# EAGLE design Codeshelf-0007.v02 (EAGLE 6.5.0)
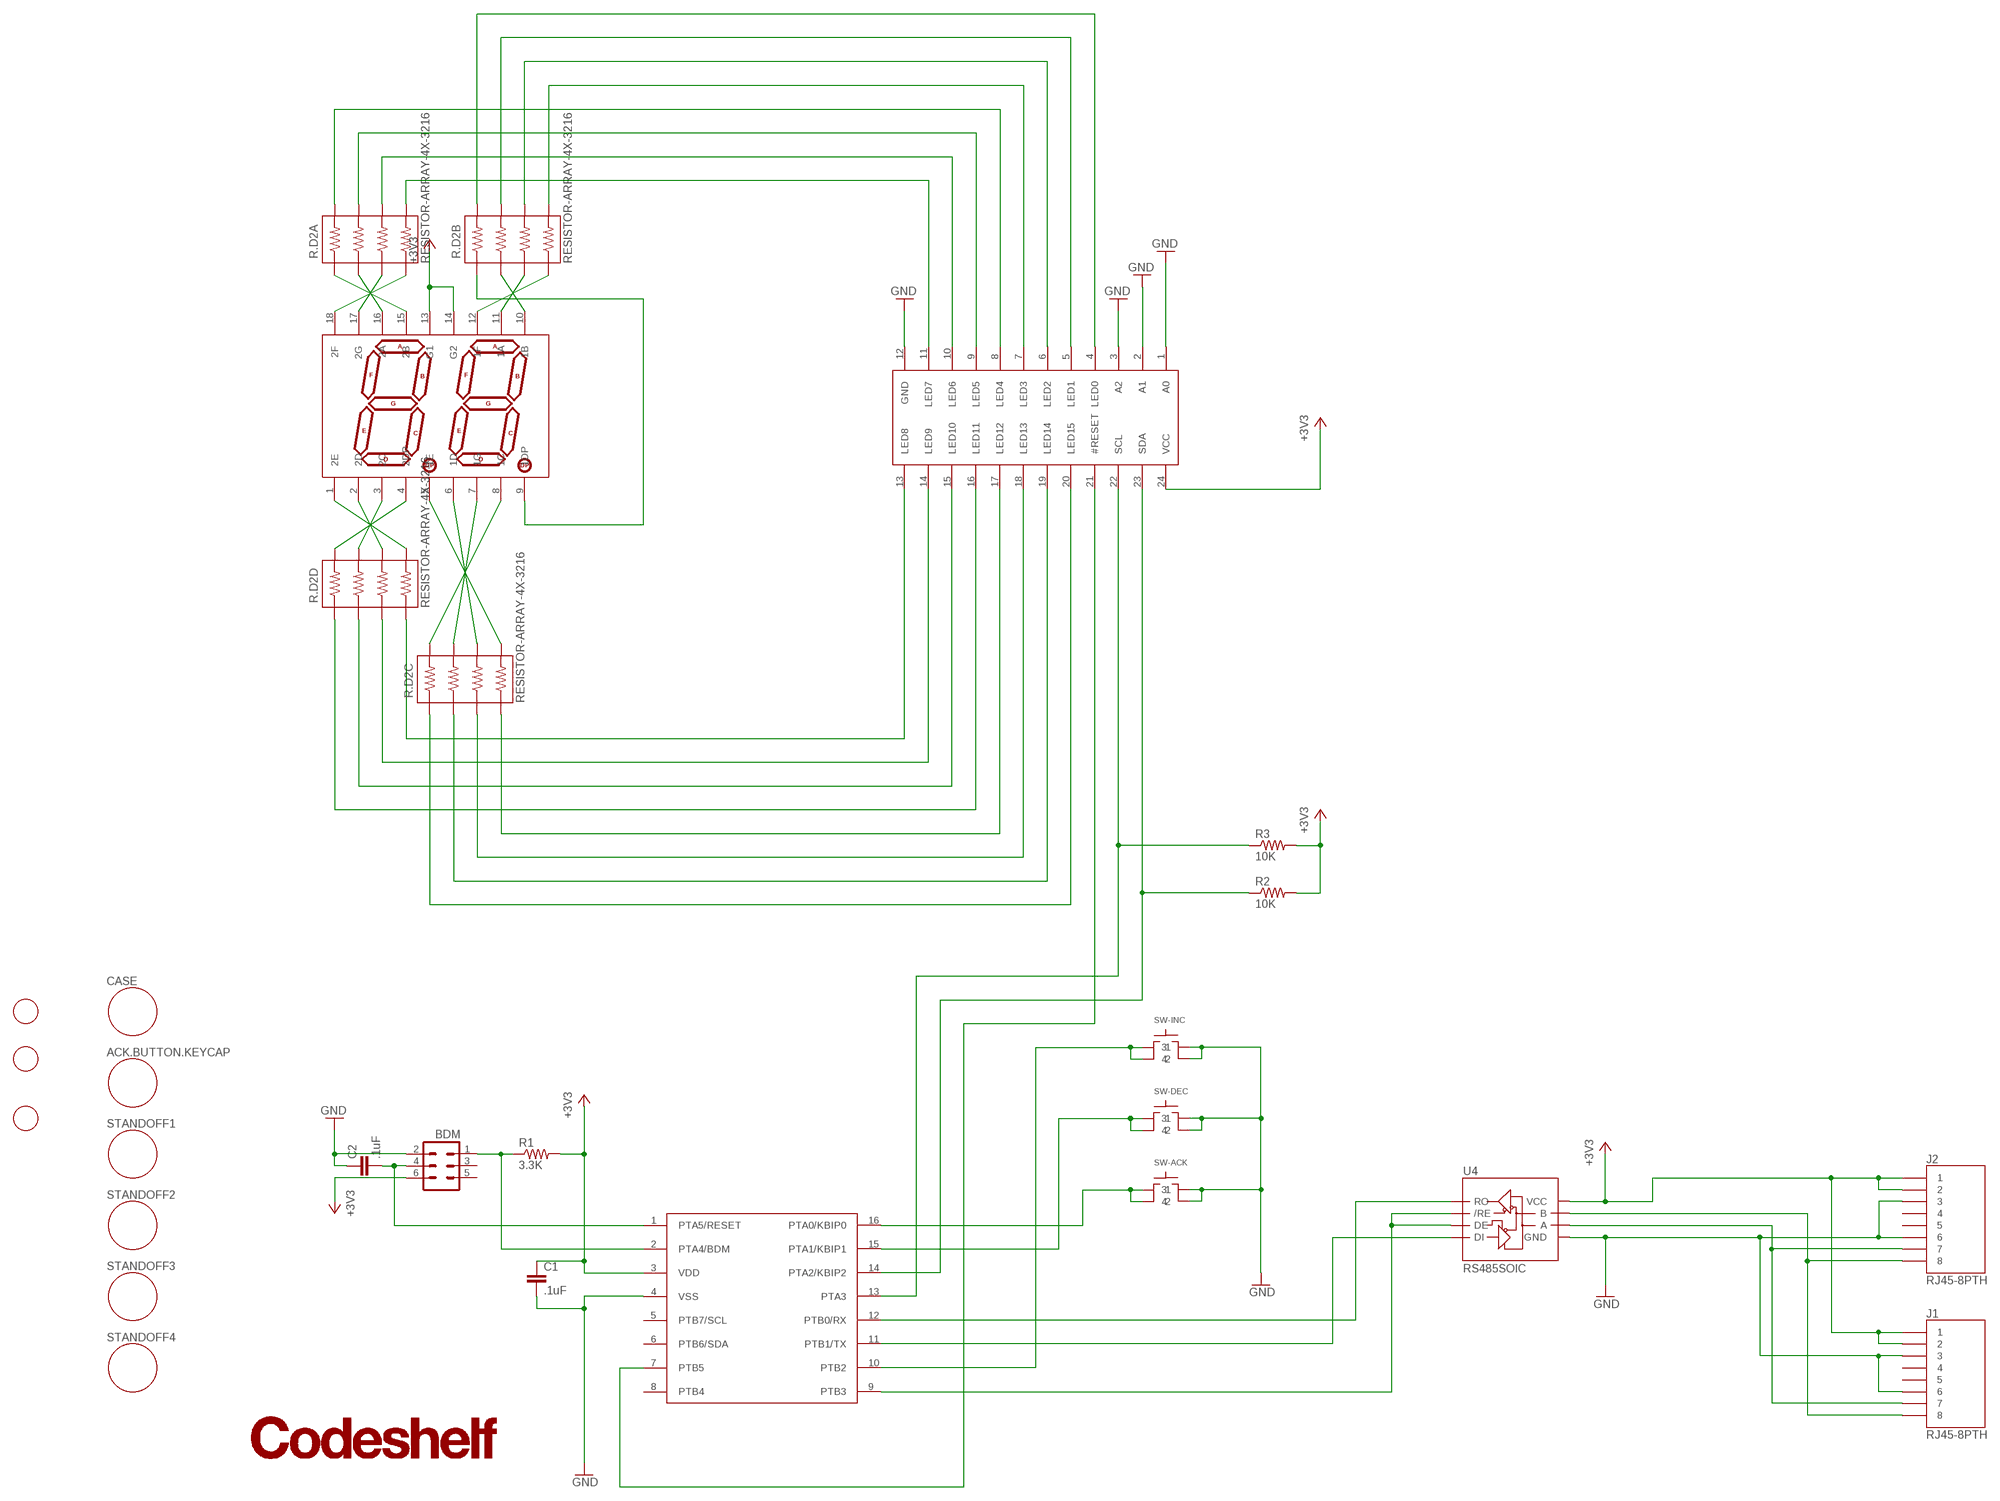
[diagram p0: schematic, sheet 1]

## Parts
ACK.BUTTON.KEYCAP  EXTERNAL-COMPONENT  [EXTERNAL-COMPONENT]
BDM  HEADER-3X2  [HEADER-3X2]
C1  .1uF  RF-C0402  [C0402]
C2  .1uF  RF-C0402  [C0402]
CASE  EXTERNAL-COMPONENT  [EXTERNAL-COMPONENT]
J1  RJ45-8PTH  [RJ45-8]
J2  RJ45-8PTH  [RJ45-8]
LOGO  CODESHELF-LOGO  [CODESHELF-LOGO]
R1  3.3K  RF-R0402  [RF-R0402]
R2  10K  RF-R0402  [RF-R0402]
R3  10K  RF-R0402  [RF-R0402]
R.D2A  RESISTOR-ARRAY-4X-3216  [3216-4X]
R.D2B  RESISTOR-ARRAY-4X-3216  [3216-4X]
R.D2C  RESISTOR-ARRAY-4X-3216  [3216-4X]
R.D2D  RESISTOR-ARRAY-4X-3216  [3216-4X]
STANDOFF1  EXTERNAL-COMPONENT  [EXTERNAL-COMPONENT]
STANDOFF2  EXTERNAL-COMPONENT  [EXTERNAL-COMPONENT]
STANDOFF3  EXTERNAL-COMPONENT  [EXTERNAL-COMPONENT]
STANDOFF4  EXTERNAL-COMPONENT  [EXTERNAL-COMPONENT]
SW-ACK  SWITCH-TACTILE-320.03E11  [SWITCH-TACTILE-320.03E11]
SW-DEC  SWITCH-TACTILE-FSM  [SWITCH-TACTILE-FSM]
SW-INC  SWITCH-TACTILE-FSM  [SWITCH-TACTILE-FSM]
U2  MC9S08QG-DT  [TSSOP16]
U3  CAT9552  [TSSOP24]
U4  RS485SOIC  [SO08]
U7  7SEGMENT-2DIGIT  [7SEGMENT-2DIG-.54]
U$1  FIDUCIAL  [FIDUCIAL_1MM]
U$2  FIDUCIAL  [FIDUCIAL_1MM]
U$3  FIDUCIAL  [FIDUCIAL_1MM]

## Nets
+3V3 [+3V3]: BDM.6 C1.1 J1.1 J1.2 J2.1 J2.2 R1.2 R2.2 R3.2 U2.3(VDD) U3.24(VCC) U4.8(VCC) U7.13(G1) U7.14(G2)
GND [GND]: BDM.2 C1.2 C2.1 J1.3 J1.6 J2.3 J2.6 SW-ACK.P$3 SW-ACK.P$4 SW-DEC.P$3 SW-DEC.P$4 SW-INC.P$3 SW-INC.P$4 U2.4(VSS) U3.1(A0) U3.2(A1) U3.3(A2) U3.12(GND) U4.5(GND)
N$1: R.D2A.5(4B) U3.11(LED7)
N$2: R.D2A.6(3B) U3.10(LED6)
N$3: R.D2A.7(2B) U3.9(LED5)
N$4: R.D2A.8(1B) U3.8(LED4)
N$5: R.D2B.5(4B) U3.7(LED3)
N$6: SW-ACK.P$1 SW-ACK.P$2 U2.16(PTA0/KBIP0)
N$7: SW-DEC.P$1 SW-DEC.P$2 U2.15(PTA1/KBIP1)
N$8: SW-INC.P$1 SW-INC.P$2 U2.10(PTB2)
N$9: BDM.1 R1.1 U2.2(PTA4/BDM)
N$10: R.D2B.6(3B) U3.6(LED2)
N$11: R.D2B.7(2B) U3.5(LED1)
N$12: R.D2B.8(1B) U3.4(LED0)
N$13: R.D2D.8(1B) U7.4(2DP)
N$14: R.D2D.7(2B) U7.3(2C)
N$15: R.D2D.6(3B) U7.2(2D)
N$16: R.D2D.5(4B) U7.1(2E)
N$17: R.D2A.1(1A) U7.15(2B)
N$18: R.D2A.2(2A) U7.16(2A)
N$19: U2.9(PTB3) U4.2(/RE) U4.3(DE)
N$20: R.D2A.3(3A) U7.17(2G)
N$21: R.D2A.4(4A) U7.18(2F)
N$22: R.D2B.4(4A) U7.12(1F)
N$23: BDM.4 C2.2 U2.1(PTA5/RESET)
N$24: R.D2B.3(3A) U7.11(1A)
N$25: R.D2C.8(1B) U7.8(1C)
N$26: R.D2C.7(2B) U7.7(1G)
N$27: R.D2C.6(3B) U7.6(1D)
N$28: R.D2C.5(4B) U7.5(1E)
N$29: R.D2B.1(1A) U7.9(1DP)
N$30: R.D2B.2(2A) U7.10(1B)
N$31: R.D2D.4(4A) U3.13(LED8)
N$32: R.D2D.3(3A) U3.14(LED9)
N$33: R.D2D.2(2A) U3.15(LED10)
N$34: R.D2D.1(1A) U3.16(LED11)
N$35: R.D2C.4(4A) U3.17(LED12)
N$36: R.D2C.3(3A) U3.18(LED13)
N$37: R.D2C.2(2A) U3.19(LED14)
N$38: R.D2C.1(1A) U3.20(LED15)
RESET: U2.7(PTB5) U3.21(#RESET)
RS485_N: J1.8 J2.8 U4.7(B)
RS485_P: J1.7 J2.7 U4.6(A)
RX: U2.12(PTB0/RX) U4.1(RO)
SLA: R2.1 U2.14(PTA2/KBIP2) U3.23(SDA)
SLC: R3.1 U2.13(PTA3) U3.22(SCL)
TX: U2.11(PTB1/TX) U4.4(DI)
Unconnected: BDM.3 BDM.5 J1.4 J1.5 J2.4 J2.5 U2.5(PTB7/SCL) U2.6(PTB6/SDA) U2.8(PTB4)

## Library data of the parts
ACK.BUTTON.KEYCAP = GW-devices:EXTERNAL-COMPONENT: Use this device to note external components needed for the BOM; MFGN: ESwitch; MFGP: 320.08RED; NOTES: DNP - non-board part; PRICE: 0.87
BDM = GW-devices:HEADER-3X2
C1 C2 = GW-devices:RF-C: RF capacitor pads for FSL reference design; MFGN: Murata; MFGP: GRM155R61C104KA88D; PRICE: 0.02
CASE = GW-devices:EXTERNAL-COMPONENT: Use this device to note external components needed for the BOM; MFGN: Bud Industries; MFGP: PN-1321-C; NOTES: DNP - non-board part; PRICE: 8.50
J1 = GW-devices:RJ45-8: RJ45 Jack MFG part number 54602-908lf; MFGN: FCI; MFGP: 54602-908LF; PRICE: 0.02
J2 = GW-devices:RJ45-8: RJ45 Jack MFG part number 54602-908lf; MFGN: FCI; MFGP: 54602-908LF; PRICE: 0.57
LOGO = GW-devices:CODESHELF-LOGO
R1 = GW-devices:RF-R: RF resistor pads for FSL reference design; MFGN: Panasonic; MFGP: ERJ-2GEJ332X; PRICE: 0.02
R2 R3 = GW-devices:RF-R: RF resistor pads for FSL reference design; MFGN: Panasonic; MFGP: ERJ-2GEJ103X; PRICE: 0.02
R.D2A R.D2B R.D2C R.D2D = GW-devices:RESISTOR-ARRAY-4X; MFGN: Yageo; MFGP: YC164-JR-07120RL; PRICE: 0.006
STANDOFF1-STANDOFF4 = GW-devices:EXTERNAL-COMPONENT: Use this device to note external components needed for the BOM; MFGN: Harwin; MFGP: R30-3001502; NOTES: DNP - non-board part; PRICE: 1.00
SW-ACK = GW-devices:SWITCH-TACTILE; MFGN: ESwitch; MFGP: 320.03E11
SW-DEC SW-INC = GW-devices:SWITCH-TACTILE; MFGN: TE Connectivity; MFGP: FSM16JH; PRICE: 0.18
U2 = GW-devices:MC9S08QG; MFGN: Freescale; MFGP: MC9S08QG8CDTER; PRICE: 1.73
U3 = GW-devices:CAT9552; MFGN: On Semiconductor; MFGP: CAT9552YI-T2; PRICE: 1.28
U4 = SparkFun:RS485; MFGN: TI; MFGP: SN65HVD1781DR; PRICE: 4.29
U7 = GW-devices:7SEGMENT-2DIGIT: 7-Segment Display 1" Red (COM-08546); MFGN: Avago; MFGP: HDSP-521E; PRICE: 0.83
U$1-U$3 = adafruit:FIDUCIAL: For use by pick and place machines to calibrate the vision/machine, 1mm By microbuilder.eu

## Net classes
1 +3V3: width 0.3 mm
2 GND: width 0.3 mm
3 RS485: width 0.4 mm

## Board
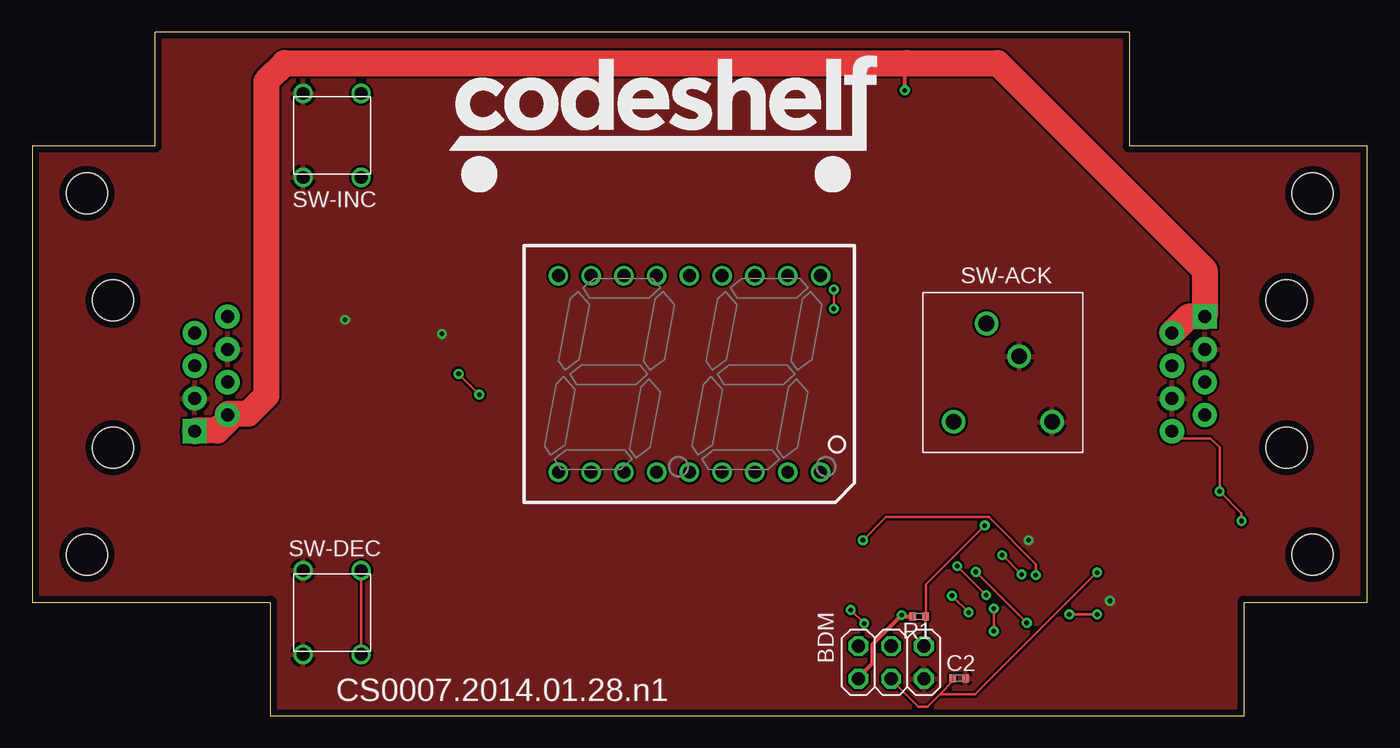
[diagram p1: board, top side]
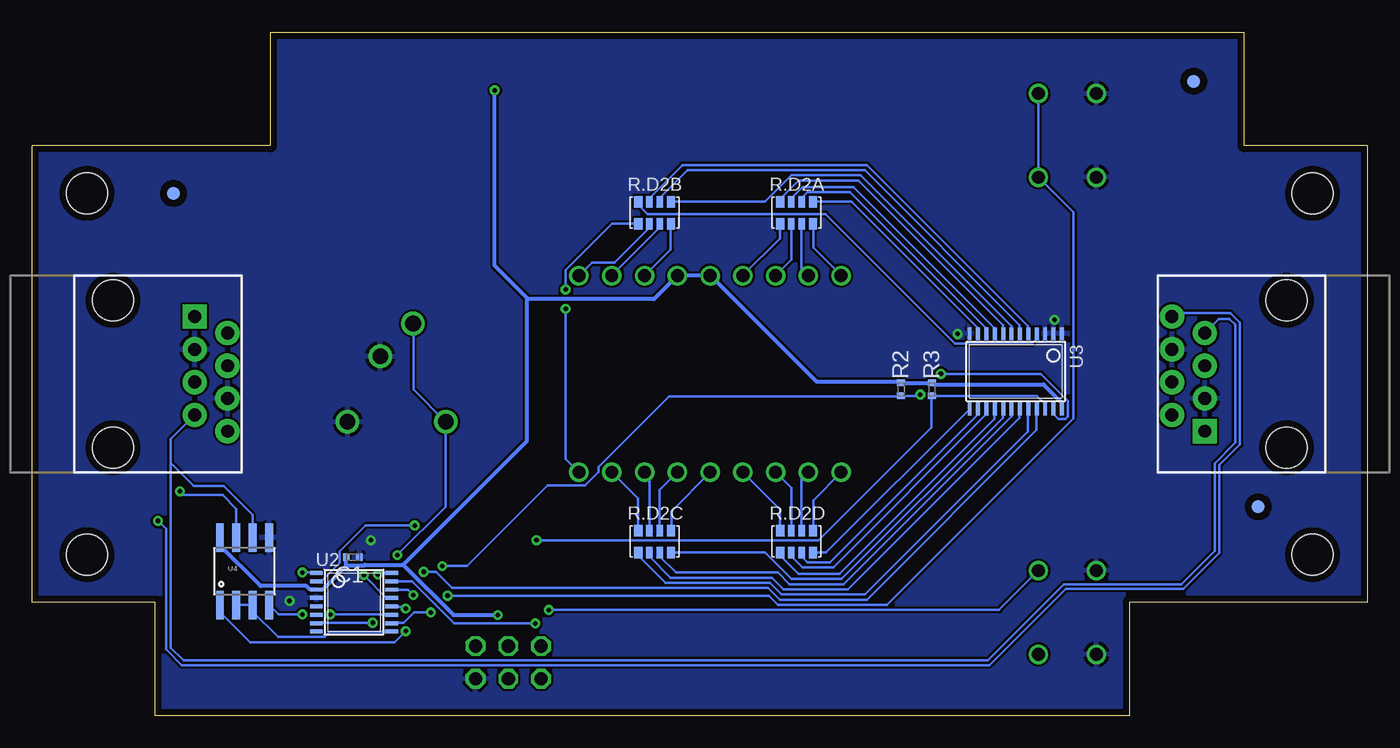
[diagram p2: board, bottom side, seen from below]

Size 103.5 x 53 mm. Coordinates in mm from the lower left corner, seen from the top.
Outline: 18.45,0 93.95,0 93.95,8.8 103.5,8.8 103.5,44.2 85.05,44.2 85.05,53 9.55,53 9.55,44.2 0,44.2 0,8.8 18.45,8.8 18.45,0
Copper layers (1*16): Top 0.0356mm / dielectric 1.5011mm / Bottom 0.0356mm
Design rules "SilverCircuits": minimum track width 7mil, minimum drill 14mil, track to track 7mil, track to pad 7mil, pad to pad 7mil, via to via 7mil, smd to smd 0mil, copper to edge 20mil, drill to drill 8mil, minimum pad ring 10mil, minimum via ring 8mil, stop-mask expansion 4mil, vias tented up to drill 0mil, thermal gap 10mil
Holes 3.2 mm at 4.25,12.5 4.25,40.5 99.25,40.5 99.25,12.5

### Footprints (pad centres in the part's own frame; a part is rotated, then mirrored left to right if it is on the bottom)
HEADER-3X2 = drill 1.016 octagon: 1 -5.08,0; 2 -5.08,2.54; 3 -2.54,0; 4 -2.54,2.54; 5 0,0; 6 0,2.54
C0402 = smd 0.5 x 0.6: 1 -0.5,0; 2 0.5,0
RJ45-8 = drill 1 pad 1.88 square: 1 -4.445,6.35 | drill 1 pad 1.88: 2 -3.175,8.89; 3 -1.905,6.35; 4 -0.635,8.89; 5 0.635,6.35; 6 1.905,8.89; 7 3.175,6.35; 8 4.445,8.89 | hole 3.2: -5.715,0; 5.715,0
RF-R0402 = smd 0.5 x 0.6: 1 -0.5,0; 2 0.5,0
3216-4X = smd 0.65 x 0.9: 1 -1.275,-0.85; 4 1.275,-0.85; 5 1.275,0.85; 8 -1.275,0.85 | smd 0.5 x 0.9: 2 -0.4,-0.85; 3 0.4,-0.85; 6 0.4,0.85; 7 -0.4,0.85
SWITCH-TACTILE-320.03E11 = drill 1.22: P$1 -3.81,-3.81; P$2 -1.27,3.81; P$3 1.27,1.27; P$4 3.81,-3.81
SWITCH-TACTILE-FSM = drill 0.99: P$1 -3.25,2.25; P$2 3.25,2.25; P$3 -3.25,-2.25; P$4 3.25,-2.25
TSSOP16 = smd 0.305 x 0.991: 1 -2.275,-2.918; 2 -1.625,-2.918; 3 -0.975,-2.918; 4 -0.325,-2.918; 5 0.325,-2.918; 6 0.975,-2.918; 7 1.625,-2.918; 8 2.275,-2.918; 9 2.275,2.918; 10 1.625,2.918; 11 0.975,2.918; 12 0.325,2.918; 13 -0.325,2.918; 14 -0.975,2.918; 15 -1.625,2.918; 16 -2.275,2.918
TSSOP24 = smd 0.305 x 0.991: 1 -3.575,-2.918; 2 -2.925,-2.918; 3 -2.275,-2.918; 4 -1.625,-2.918; 5 -0.975,-2.918; 6 -0.325,-2.918; 7 0.325,-2.918; 8 0.975,-2.918; 9 1.625,-2.918; 10 2.275,-2.918; 11 2.925,-2.918; 12 3.575,-2.918; 13 3.575,2.918; 14 2.925,2.918; 15 2.275,2.918; 16 1.625,2.918; 17 0.975,2.918; 18 0.325,2.918; 19 -0.325,2.918; 20 -0.975,2.918; 21 -1.625,2.918; 22 -2.275,2.918; 23 -2.925,2.918; 24 -3.575,2.918
SO08 = smd 0.61 x 2.21: 1 -1.905,-2.616; 2 -0.635,-2.616; 3 0.635,-2.616; 4 1.905,-2.616; 5 1.905,2.616; 6 0.635,2.616; 7 -0.635,2.616; 8 -1.905,2.616
7SEGMENT-2DIG-.54 = drill 1: 1 -10.16,-7.62; 2 -7.62,-7.62; 3 -5.08,-7.62; 4 -2.54,-7.62; 5 0,-7.62; 6 2.54,-7.62; 7 5.08,-7.62; 8 7.62,-7.62; 9 10.16,-7.62; 10 10.16,7.62; 11 7.62,7.62; 12 5.08,7.62; 13 2.54,7.62; 14 0,7.62; 15 -2.54,7.62; 16 -5.08,7.62; 17 -7.62,7.62; 18 -10.16,7.62
FIDUCIAL_1MM = smd 1 x 1: 1 0,0

### Placement (x,y rotation side)
ACK.BUTTON.KEYCAP  95.95,50.9 0 top
BDM  64.05,5.4 180 top
C1  78.63,12.3 0 bottom
C2  71.85,2.9 180 top
CASE  97.55,52.6 0 top
J1  97.25,26.5 270 bottom
J2  6.25,26.5 90 bottom
LOGO  32.35,40.6 0 top
R1  68.75,7.7 180 top
R2  36.15,25.3 90 bottom
R3  33.75,25.3 90 bottom
R.D2A  44.25,39 0 bottom
R.D2B  55.25,39 0 bottom
R.D2C  55.25,13.5 0 bottom
R.D2D  44.25,13.5 0 bottom
STANDOFF1  94.35,49.2 0 top
STANDOFF2  92.75,47.5 0 top
STANDOFF3  91.75,46.4 0 top
STANDOFF4  88.95,47.7 0 top
SW-ACK  75.25,26.6 0 top
SW-DEC  23.25,8 270 top
SW-INC  23.25,45 270 top
U2  78.55,8.8 270 bottom
U3  27.25,26.7 180 bottom
U4  87.05,11.2 0 bottom
U7  50.95,26.5 0 top
U$1  8.45,16.2 0 bottom
U$2  13.45,49.2 0 bottom
U$3  92.55,40.5 0 bottom

### Tracks (layer width: path | path; a pad name or v marks a point on that pad's centre or on a via)
+3V3  (via drill 0.36)
  Top 0.3: v67.65,48.5 67.65,50.4 67.85,50.6 | 67.4,7.7 67.3,7.7 65.15,5.55 65.15,4.05 64.05,2.95 BDM.6 | 67.4,7.7 R1.2 | v67.4,7.8 67.4,7.7
  Top 2: J2.1 12.64,22.1 14.35,22.1 15.14,22.89 J2.2 15.21,23.4 16.75,23.4 18.15,24.8 18.15,49.2 19.55,50.6 67.85,50.6 74.85,50.6 90.9,34.55 J1.1 89.63,30.95 J1.2
  Bottom 0.3: 65.05,32.3 55.31,32.3 U7.13 U7.14 50.85,34.05 42.7,25.9 36.25,25.9 R2.2 R3.2 33.65,25.7 25.1,25.7 23.7,24.3 23.7,23.8 U3.24 | 65.05,32.3 67.65,34.9 v67.65,48.5 | 79.15,11.65 79.15,11.6 80.95,9.8 81.45,9.8 U2.3 81.6,9.8 82,9.8 82.25,10.05 85.8,10.05 88.95,13.2 88.95,13.8 U4.8 | 79.15,11.65 79.15,12.3 C1.1 | v67.4,7.8 70.85,7.8 74.75,11.7 | 74.75,11.7 77.7,11.7 77.75,11.65 79.15,11.65 | 74.75,11.7 65.15,21.3 65.15,32.2 65.05,32.3
GND  (via drill 0.36)
  other vias: 24.25,30.7 31.75,29.6 77.25,13.6 83.55,8.9
  pour Top: 0.25,9.3 0.25,43.7 9.55,43.7 9.55,53 85.05,53 85.05,43.7 103.25,43.7 103.25,9.2 93.95,9.2 93.95,0 18.45,0 18.45,9.3
  pour Bottom: 0.25,9.3 0.25,43.7 9.55,43.7 9.55,53 85.05,53 85.05,43.7 103.25,43.7 103.25,9.2 93.95,9.2 93.95,0 18.45,0 18.45,9.3
N$1
  Bottom 0.178: R.D2A.5 40,39.85 30.2,30.05 30.2,29.65 U3.11
N$2
  Bottom 0.178: R.D2A.6 43.85,40.15 43.4,40.6 40.1,40.6 29.55,30.05 29.55,29.65 U3.10
N$3
  Bottom 0.178: R.D2A.7 44.65,40.15 43.8,41 39.85,41 28.9,30.05 28.9,29.65 U3.9
N$4
  Bottom 0.178: R.D2A.8 45.5,39.85 45.5,40.1 44.1,41.5 39.45,41.5 28.25,30.3 28.25,29.65 U3.8
N$5
  Bottom 0.178: R.D2B.5 46.7,39.85 44.65,41.9 39.3,41.9 27.6,30.2 27.6,29.65 U3.7
N$6  (via drill 0.36)
  Top 0.178: v75.2,12.45 v76.7,10.95
  Bottom 0.178: v76.7,10.95 76.6,11.05 75.65,11.05 U2.16 | v75.2,12.45 71.45,16.2 71.45,22.75 SW-ACK.P$1 73.95,25.3 73.95,30.4 SW-ACK.P$2
N$7  (via drill 0.36)
  Top 0.178: v63.45,8.2 v64.5,7.15 | SW-DEC.P$1 SW-DEC.P$2
  Bottom 0.178: v64.5,7.15 70.8,7.15 74.05,10.4 75.6,10.4 U2.15 | v63.45,8.2 28.55,8.2 SW-DEC.P$1
N$8  (via drill 0.36)
  Top 0.178: v71.3,9.3 v72.6,8
  Bottom 0.178: v72.6,8 73.9,8 74.7,7.2 75.6,7.2 U2.10 | v71.3,9.3 46.4,9.3 45.7,8.6 37.25,8.6 22.8,23.05 22.8,39.05 SW-INC.P$2 SW-INC.P$1
N$9  (via drill 0.36)
  Top 0.178: BDM.1 69.15,5.4 69.25,5.5 R1.1 69.3,7.75 69.3,10.2 v73.85,14.75
  Bottom 0.178: v73.85,14.75 77.65,14.75 79.65,12.75 79.65,11.85 81.05,10.45 81.45,10.45 U2.2
N$10
  Bottom 0.178: R.D2B.6 54.85,40.15 52.7,42.3 38.95,42.3 26.95,30.3 26.95,29.65 U3.6
N$11
  Bottom 0.178: R.D2B.7 55.65,40.15 53.1,42.7 38.8,42.7 26.3,30.2 26.3,29.65 U3.5
N$12
  Bottom 0.178: R.D2B.8 56.5,39.85 56.5,39.6 55.8,38.9 42,38.9 31.95,28.85 26,28.85 25.65,29.2 25.65,29.6 U3.4
N$13
  Bottom 0.178: R.D2D.8 45.55,14.35 45.55,16 48.4,18.85 U7.4
N$14
  Bottom 0.178: R.D2D.7 44.65,17.65 45.85,18.85 U7.3
N$15
  Bottom 0.178: R.D2D.6 43.85,18.35 43.35,18.85 U7.2
N$16
  Bottom 0.178: R.D2D.5 42.95,14.35 42.95,16.7 40.8,18.85 U7.1
N$17
  Bottom 0.178: R.D2A.1 45.55,38.15 45.55,37 48.4,34.15 U7.15
N$18
  Bottom 0.178: R.D2A.2 44.65,35.35 45.85,34.15 U7.16
N$19
  Bottom 0.178: U2.9 75.65,6.5 80.45,6.5 80.85,6.1 84.45,6.1 86.4,8.05 86.4,8.55 U4.3 86.5,8.6 87.65,8.6 U4.2
N$20
  Bottom 0.178: R.D2A.3 43.85,34.65 43.35,34.15 U7.17
N$21
  Bottom 0.178: R.D2A.4 42.95,38.15 42.95,36.3 40.8,34.15 U7.18
N$22
  Bottom 0.178: U7.12 54,36.15 54,38.15 R.D2B.4
N$23  (via drill 0.36)
  Top 0.178: C2.2 71.35,2.65 70.4,1.7 | 70.4,1.7 69.4,0.7 68.7,0.7 66.55,2.85 BDM.4 | v82.55,11.1 73.1,1.65 70.45,1.65 70.4,1.7
  Bottom 0.178: v82.55,11.1 81.5,11.1 U2.1
N$24
  Bottom 0.178: R.D2B.3 54.85,37.85 58.55,34.15 U7.11
N$25
  Bottom 0.178: R.D2C.8 56.55,14.35 56.55,16.85 58.55,18.85 U7.8
N$26
  Bottom 0.178: R.D2C.7 55.65,18.5 U7.7
N$27
  Bottom 0.178: R.D2C.6 54.85,17.5 53.5,18.85 U7.6
N$28
  Bottom 0.178: R.D2C.5 53.95,14.35 53.95,15.85 50.95,18.85 U7.5
N$29  (via drill 0.36)
  Top 0.178: v62.15,31.55 v62.15,33.05
  Bottom 0.178: R.D2B.1 58.55,38.15 62.15,34.55 v62.15,33.05 | v62.15,31.55 62.15,19.9 61.15,18.9 U7.9
N$30
  Bottom 0.178: R.D2B.2 55.65,37.85 58.35,35.15 60.1,35.15 61.1,34.15 U7.10
N$31
  Bottom 0.178: R.D2D.4 41.95,12.65 30.85,23.75 U3.13
N$32
  Bottom 0.178: R.D2D.3 43.85,12.35 43.4,11.9 41.65,11.9 30.2,23.35 30.2,23.75 U3.14
N$33
  Bottom 0.178: R.D2D.2 44.65,12.35 43.8,11.5 41.4,11.5 29.55,23.35 29.55,23.75 U3.15
N$34
  Bottom 0.178: R.D2D.1 45.5,12.65 45.5,12.4 44.1,11 40.9,11 28.9,23 28.9,23.75 U3.16
N$35
  Bottom 0.178: R.D2C.4 46.7,12.65 44.65,10.6 40.75,10.6 28.25,23.1 28.25,23.75 U3.17
N$36
  Bottom 0.178: R.D2C.3 54.85,12.35 53.6,11.1 45.7,11.1 44.8,10.2 40.6,10.2 27.6,23.2 27.6,23.75 U3.18
N$37
  Bottom 0.178: R.D2C.2 55.65,12.35 54,10.7 46.15,10.7 45.25,9.8 40.25,9.8 26.95,23.1 26.95,23.75 U3.19
N$38
  Bottom 0.178: R.D2C.1 56.5,12.65 56.5,12.4 54.4,10.3 46.3,10.3 45.4,9.4 38.95,9.4 26.3,22.05 26.3,23.75 U3.20
RESET  (via drill 0.36)
  Top 0.178: v77.1,7.2 v73.15,11.15
  Bottom 0.178: v73.15,11.15 72.2,11.15 70.95,9.9 46.45,9.9 45.55,9 38.8,9 25.65,22.15 25.65,23.75 U3.21 | v77.1,7.2 81.45,7.2 U2.7
RS485_N  (via drill 0.36)
  Top 0.178: J1.8 88.92,21.5 91.35,21.5 92.05,20.8 v92.05,17.4 93.75,15.7 v93.75,15.1
  Bottom 0.178: U4.7 87.69,16.04 88.75,17.1 91.75,17.1 v92.05,17.4 | J2.8 14.86,31.23 10.62,31.23 9.87,30.47 9.87,21.03 11.47,19.43 11.47,12.63 14.28,9.82 23.38,9.82 29.28,3.92 91.92,3.92 93.13,5.13 93.13,14.48 v93.75,15.1
RS485_P
  Bottom 0.178: 92.77,19.6 92.77,5.27 91.78,4.28 29.42,4.28 23.52,10.18 14.42,10.18 11.83,12.77 11.83,19.57 10.23,21.17 10.23,30.33 10.68,30.77 11.5,30.77 J2.7 | 92.77,19.6 92.77,21.45 J1.7 | U4.6 86.42,15.56 88.65,17.8 90.97,17.8 92.77,19.6
RX  (via drill 0.36)
  Top 0.178: v74.55,6.55 v74.55,8.3
  Bottom 0.178: v74.55,8.3 74.7,8.45 75.6,8.45 U2.12 | v74.55,6.55 75.4,5.7 86.6,5.7 88.95,8.05 88.95,8.55 U4.1
SLA  (via drill 0.36)
  Top 0.178: v33.05,26.5 v34.65,24.9 | v71.7,11.6 v73.95,9.35
  Bottom 0.178: v34.65,24.9 34.75,24.8 R2.1 36.2,24.75 54.15,24.75 59.6,19.3 59.6,18.9 60.65,17.85 63.55,17.85 69.8,11.6 v71.7,11.6 | v33.05,26.5 25.3,26.5 23.2,24.4 23.2,23.2 23.4,23 23.95,23 24.3,23.35 24.3,23.75 U3.23 | v73.95,9.35 74.35,9.75 75.6,9.75 U2.14
SLC  (via drill 0.36)
  Top 0.178: v77.8,10.9 77.8,11.75 74.15,15.4 66.2,15.4 v64.4,13.6
  Bottom 0.178: U3.22 25,23.8 25,24.2 25.6,24.8 R3.1 33.8,24.75 33.8,22.35 42.55,13.6 v64.4,13.6 | v77.8,10.9 76.05,9.15 75.65,9.15 U2.13
TX  (via drill 0.36)
  Top 0.178: v82.55,7.85 v80.4,7.85
  Bottom 0.178: v80.4,7.85 75.65,7.85 U2.11 | v82.55,7.85 84.4,7.85 85.1,8.55 U4.4

### Text on the board
tPlace: CS0007.2014.01.28.n1